# Altium schematic sheet Sheet1.SchDoc
size A4
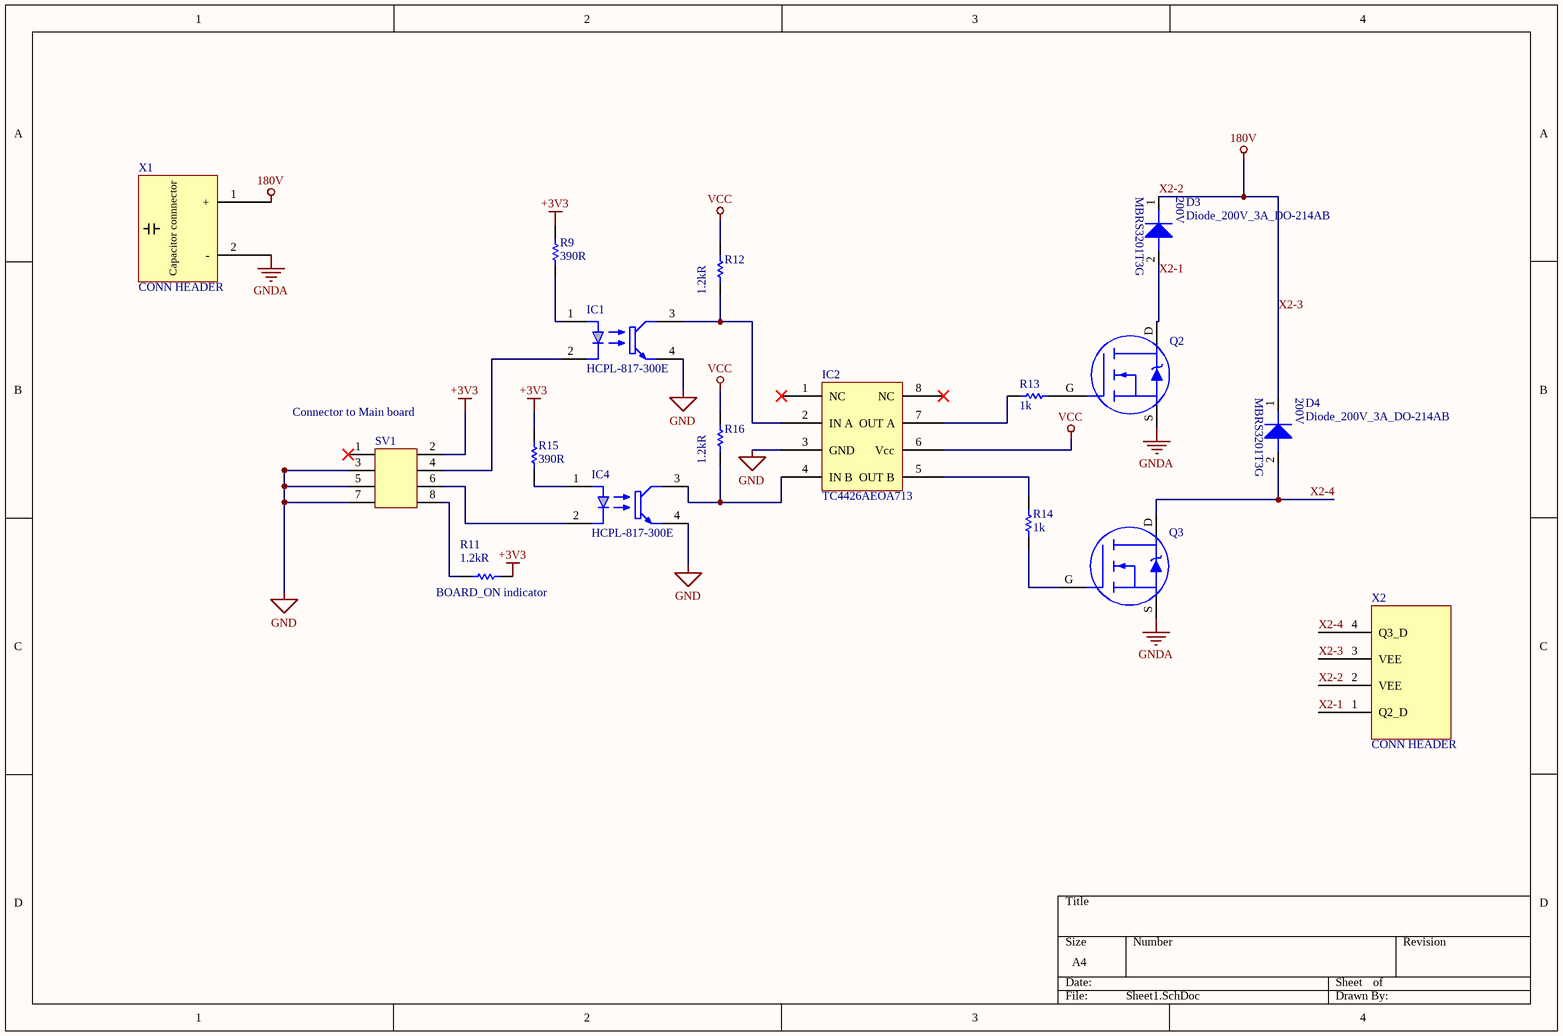
[diagram p0: Sheet1.SchDoc]

## Parts
D3  Diode_200V_3A_DO-214AB  [D320]
D4  Diode_200V_3A_DO-214AB  [D320]
IC1  HCPL-817-300E  [OPTOISOLATOR_5KV_TRANSISTOR_4SMD]
IC2  TC4426AEOA713  [CI Driver]
IC4  HCPL-817-300E  [OPTOISOLATOR_5KV_TRANSISTOR_4SMD]
Q2  IRFSL4127PBF  [TO-262]  (value not drawn)
Q3  IRFSL4127PBF  [TO-262]  (value not drawn)
R9  390R  [Resistor_0805]
R11  Res_1.2K_0805_1%  [0805]  (value not drawn)
R12  Res_1.2K_0805_1%  [0805]  (value not drawn)
R13  1k  [Resistor_0805]
R14  1k  [Resistor_0805]
R15  390R  [Resistor_0805]
R16  Res_1.2K_0805_1%  [0805]  (value not drawn)
SV1  90131-0764  [CONN HEADER VERT 8POS 2.54MM]  (value not drawn)
X1  CONN HEADER  [CONN HEADER R_A 2POS 3.98MM]
X2  CONN HEADER  [CONN HEADER R_A 4POS 3.98MM]

## Nets
+3V3: R9.2 R11.2 R15.2 SV1.2
GND: IC1.4(Emitter) IC2.3(GND) IC4.4(Emitter) SV1.3 SV1.5 SV1.7
GNDA: Q2.S Q3.S X1.2(-)
VCC: IC2.6(Vcc) R12.2 R16.2
X2-2: D3.1 D4.1 X1.1(+) X2.2(VEE) X2.3(VEE)  [also labelled 180V, X2-3]
X2-1: D3.2 Q2.D X2.1(Q2_D)
X2-4: D4.2 Q3.D X2.4(Q3_D)
NetIC1_1: IC1.1(Anode) R9.1
NetIC1_2: IC1.2(Cathode) SV1.4
NetIC1_3: IC1.3(Collector) IC2.2(IN_A) R12.1
NetIC2_4: IC2.4(IN_B) IC4.3(Collector) R16.1
NetIC2_5: IC2.5(OUT_B) R14.2
NetIC2_7: IC2.7(OUT_A) R13.1
NetIC4_1: IC4.1(Anode) R15.1
NetIC4_2: IC4.2(Cathode) SV1.6
NetQ2_G: Q2.G R13.2
NetQ3_G: Q3.G R14.1
NetR11_1: R11.1 SV1.8

Not connected (* = marked no-connect by the designer): IC2 1(NC)* 8(NC)*; SV1 1*

## Notes on the sheet
- (near SV1) Connector to Main board
- (near R11) BOARD_ON indicator
- (in symbol CONN HEADER R_A 2POS 3.96MM) Capacitor connnector

## Library data of the parts
D3 D4 = Diode_200V_3A_DO-214AB: ON SEMICONDUCTOR - MBRS3201T3G - Schottky Rectifier, 200 V, 3 A, Single, DO-214AB (SMC), 2 Pins, 840 mV; Peak Reverse Current: 5uA; Max Surge Current: 100A; Forward Voltage: 840mV; Forward Current: 3A; Recovery Time: 35ns; Max Repetitive Reverse Voltage (Vrrm): 200V; Polarity: Standard; Supplier 1: Digi-Key; Manufacturer: ON Semiconductor; Manufacturer Part Number: MBRS3201T3G; RoHS: Yes; Category: Schottky Diodes; Stock 1: 6509; Pricing 1: 1=0,60000, 10=0,53200, 25=0,49960, 100=0,36270, 250=0,34980, 500=0,30306, 1000=0,25792 (USD); Case/Package: SMC; Number of Pins: 2; Contact Plating: Tin,Matte; Min Operating Temperature: -55°C; Max Operating Temperature: 150°C; Package Quantity: 2500; Packaging: Tape and Reel; Average Rectified Current: 3A; Reverse Recovery Time: 35ns; Max Reverse Leakage Current: 5uA; Peak Non-Repetitive Surge Current: 100A; Max Forward Surge Current (Ifsm): 100A; Element Configuration: Single; Voltage Rating (DC): 200V; Current Rating: 3A; Output Current: 3A; Max Reverse Voltage (DC): 200V; Length: 7.11mm; Height: 2.26mm; Width: 6.1mm; Radiation Hardening: No; REACH SVHC: No SVHC; Lead Free: Lead Free; Halogen Free: Halogen Free; ComponentLink1URL: https://datasheet.ciiva.com/923/mbrs3201t3-d-923290.pdf?src-supplier=Avnet; ComponentLink1Description: https://datasheet.ciiva.com/923/mbrs3201t3-d-923290.pdf?src-supplier=Avnet; ComponentLink2URL: https://datasheet.ciiva.com/22659/1708281-22659072.pdf?src-supplier=Element14; ComponentLink2Description: https://datasheet.ciiva.com/22659/1708281-22659072.pdf?src-supplier=Element14; ComponentLink3URL: https://datasheet.ciiva.com/916/mbrs3201t3-916256.pdf?src-supplier=Digi-Key; ComponentLink3Description: https://datasheet.ciiva.com/916/mbrs3201t3-916256.pdf?src-supplier=Digi-Key; ComponentLink4URL: https://datasheet.ciiva.com/26912/getdatasheetpartid-105192-26912741.pdf?src-supplier=Verical; ComponentLink4Description: https://datasheet.ciiva.com/26912/getdatasheetpartid-105192-26912741.pdf?src-supplier=Verical; ComponentLink5URL: https://datasheet.ciiva.com/25948/mbrs3201t3-d-25948165.pdf?src-supplier=Avnet+Europe; ComponentLink5Description: https://datasheet.ciiva.com/25948/mbrs3201t3-d-25948165.pdf?src-supplier=Avnet+Europe; ComponentLink6URL: https://datasheet.ciiva.com/8294/mbrs3201t3-d-8294973.pdf?src-supplier=Avnet; ComponentLink6Description: https://datasheet.ciiva.com/8294/mbrs3201t3-d-8294973.pdf?src-supplier=Avnet; ComponentLink7URL: https://datasheet.ciiva.com/916/mbrs3201t3-d-916255.pdf?src-supplier=Digi-Key; ComponentLink7Description: https://datasheet.ciiva.com/916/mbrs3201t3-d-916255.pdf?src-supplier=Digi-Key; ComponentLink8URL: https://datasheet.ciiva.com/916/mbrs3201t3-d-916257.pdf?src-supplier=Digi-Key; ComponentLink8Description: https://datasheet.ciiva.com/916/mbrs3201t3-d-916257.pdf?src-supplier=Digi-Key; ComponentLink9URL: https://datasheet.ciiva.com/16393/mbrs3201t3-d-16393647.pdf?src-supplier=Future+Electronics; ComponentLink9Description: https://datasheet.ciiva.com/16393/mbrs3201t3-d-16393647.pdf?src-supplier=Future+Electronics; Supplier Part Number 1: MBRS3201T3GOSCT-ND
IC1 IC4 = HCPL-817-300E: OPTOISOLATOR 5KV TRANSISTOR 4SMD; Manufacturer: Broadcom Avago; Number of Channels: 1; Forward Current: 50mA; Forward Voltage: 1.4V; Collector Emitter Voltage (VCEO): 35V; Max Output Voltage: 70V; Max Power Dissipation: 200mW; Rise Time: 18000ns; Reverse Breakdown Voltage: 6V; Current Transfer Ratio: 600%; Collector Emitter Saturation Voltage: 200mV; Input Current: 20mA; Approvals: UL,CSA,VDE; Supplier 1: Digi-Key; Manufacturer Part Number: HCPL-817-300E; RoHS: Yes; Category: Optocouplers; Stock 1: 19011; Pricing 1: 1=0,62000, 10=0,44500, 100=0,29090, 500=0,20908, 1000=0,16362, 2500=0,14998, 5000=0,13635, 10000=0,12726, 25000=0,12272 (USD); Mount: Surface Mount; Case/Package: SMD/SMT; Number of Pins: 4; Contact Plating: Tin,Matte; Min Operating Temperature: -30°C; Max Operating Temperature: 100°C; Packaging: Rail/Tube; Output Current per Channel: 50mA; Isolation Voltage: 5kV; Package Quantity: 100; Max Collector Current: 50mA; Max Input Current: 50mA; Fall Time: 18000ns; Number of Elements: 1; Power Dissipation: 200mW; Number of Circuits: 1; Radiation Hardening: No; REACH SVHC: No SVHC; Lead Free: Lead Free; ComponentLink1URL: https://datasheet.ciiva.com/14169/av02-0265en-14169345.pdf?src-supplier=Distrelec; ComponentLink1Description: https://datasheet.ciiva.com/14169/av02-0265en-14169345.pdf?src-supplier=Distrelec; ComponentLink2URL: https://datasheet.ciiva.com/11771/0900766b80db8749-11771859.pdf?src-supplier=RSComponents; ComponentLink2Description: https://datasheet.ciiva.com/11771/0900766b80db8749-11771859.pdf?src-supplier=RSComponents; ComponentLink3URL: https://datasheet.ciiva.com/15118/getdatasheetpartid-148838-15118837.pdf?src-supplier=Verical; ComponentLink3Description: https://datasheet.ciiva.com/15118/getdatasheetpartid-148838-15118837.pdf?src-supplier=Verical; ComponentLink4URL: https://datasheet.ciiva.com/29301/140230-da-01-en-fototransistor-optokoppler-hcpl-817-300e-29301503.pdf?src-supplier=Conrad; ComponentLink4Description: https://datasheet.ciiva.com/29301/140230-da-01-en-fototransistor-optokoppler-hcpl-817-300e-29301503.pdf?src-supplier=Conrad; ComponentLink5URL: https://datasheet.ciiva.com/4702/v02-0265en-106799-4702250.pdf?src-supplier=Mouser; ComponentLink5Description: https://datasheet.ciiva.com/4702/v02-0265en-106799-4702250.pdf?src-supplier=Mouser; ComponentLink6URL: https://datasheet.ciiva.com/8065/1266126-8065797.pdf?src-supplier=Element14; ComponentLink6Description: https://datasheet.ciiva.com/8065/1266126-8065797.pdf?src-supplier=Element14
IC2 = TC4426AEOA713: MOSFET DRVR 1.5A 2-OUT Lo Side Inv 8-Pin SOIC N T/R; Manufacturer: Microchip; Supplier 1: Digi-Key; Manufacturer Part Number: TC4426AEOA713; RoHS: Yes; Category: Gate Drivers; Stock 1: 3145; Pricing 1: 1=1,32000, 25=1,10000, 100=1,00000 (USD); ComponentLink1URL: https://datasheet.ciiva.com/1951/filehandler-aspxddocname-en026002-1951430.pdf?src-supplier=Digi-Key; ComponentLink1Description: https://datasheet.ciiva.com/1951/filehandler-aspxddocname-en026002-1951430.pdf?src-supplier=Digi-Key; ComponentLink2URL: https://datasheet.ciiva.com/16293/21422e-16293354.pdf?src-supplier=Future+Electronics; ComponentLink2Description: https://datasheet.ciiva.com/16293/21422e-16293354.pdf?src-supplier=Future+Electronics; ComponentLink3URL: https://datasheet.ciiva.com/17236/21423f-17236125.pdf?src-supplier=Avnet+Europe; ComponentLink3Description: https://datasheet.ciiva.com/17236/21423f-17236125.pdf?src-supplier=Avnet+Europe; ComponentLink4URL: https://datasheet.ciiva.com/8199/21423f-8199823.pdf?src-supplier=Avnet; ComponentLink4Description: https://datasheet.ciiva.com/8199/21423f-8199823.pdf?src-supplier=Avnet
Q2 Q3 = IRFSL4127PBF: 200V Single N-Channel HEXFET Power MOSFET Switch in a TO-262 package; Manufacturer: Infineon; Turn-Off Delay Time: 56ns; Turn-On Delay Time: 17ns; Gate to Source Voltage (Vgs): 20V; Power Dissipation: 375W; Drain to Source Resistance: 22mR; Supplier 1: Mouser; Manufacturer Part Number: IRFSL4127PBF; RoHS: Yes; Category: MOSFETs; Stock 1: 44; Pricing 1: 1=4,88000, 10=4,15000, 100=3,32000, 500=2,95000, 1000=2,63000, 2000=2,63000 (USD); Mount: Through Hole; Case/Package: TO-262; Number of Pins: 3; Min Operating Temperature: -55°C; Max Operating Temperature: 175°C; Drain to Source Voltage (Vdss): 200V; Max Dual Supply Voltage: 200V; Length: 0.42inch; Height: 0.38inch; Width: 0.19inch; Lead Free: Lead Free; Halogen Free: Halogen Free; ComponentLink1URL: https://www.alliedelec.com/m/d/905bffad1195b62bb948415acb3fbc50.pdf?src-supplier=Allied+Electronics; ComponentLink1Description: https://www.alliedelec.com/m/d/905bffad1195b62bb948415acb3fbc50.pdf?src-supplier=Allied+Electronics
R9 R15 = Res_390R_0805: RES SMD 0805 390R 5% 1/8W; Tolerance: 1%; Value: 1K; Supplier 1: Digi-Key; Supplier Part Number 1: 311-390ARDKR-ND
R11 R12 R16 = Res_1.2K_0805_1%: PANASONIC ELECTRONIC COMPONENTS - ERJ6ENF1201V - RES, THICK FILM, 1K2, 125MW, 1%, REEL; Manufacturer Part Number: ERJ-6ENF1201V; Resistance: 1.2kR; Temperature Coefficient: 100ppm/°C; Voltage Rating: 150V; Supplier 1: Digi-Key; Manufacturer: Panasonic; RoHS: Yes; Category: Chip SMD Resistors; Stock 1: 22603; Pricing 1: 1=0,10000, 10=0,07200, 100=0,02750, 1000=0,01210, 2500=0,01045 (USD); Mount: Surface Mount; Case/Package: 0805; Contact Plating: Tin; Case Code (Metric): 2012; Case Code (Imperial): 0805; Min Operating Temperature: -55°C; Max Operating Temperature: 155°C; Tolerance: 1%; Composition: Thick Film; Power Rating: 125mW; Packaging: Tape and Reel; Package Quantity: 1; Number of Terminations: 2; Military Standard: Not; Max Power Dissipation: 125mW; Termination: SMD/SMT; Voltage Rating (DC): 150V; Features: Automotive AEC-Q200; Length: 2mm; Height: 0.6mm; Width: 0.049inch; Depth: 1.25mm; Radiation Hardening: No; Lead Free: Lead Free; REACH SVHC: No SVHC; ComponentLink1URL: https://datasheet.ciiva.com/11821/0900766b80f80784-11821543.pdf?src-supplier=RSComponents; ComponentLink1Description: https://datasheet.ciiva.com/11821/0900766b80f80784-11821543.pdf?src-supplier=RSComponents; ComponentLink2URL: https://datasheet.ciiva.com/7802/426256-7802438.pdf?src-supplier=Element14; ComponentLink2Description: https://datasheet.ciiva.com/7802/426256-7802438.pdf?src-supplier=Element14; ComponentLink3URL: https://datasheet.ciiva.com/16775/70260748-16775350.pdf?src-supplier=Allied+Electronics; ComponentLink3Description: https://datasheet.ciiva.com/16775/70260748-16775350.pdf?src-supplier=Allied+Electronics; ComponentLink4URL: https://datasheet.ciiva.com/9198/aoa0000ce2-9198663.pdf?src-supplier=Avnet; ComponentLink4Description: https://datasheet.ciiva.com/9198/aoa0000ce2-9198663.pdf?src-supplier=Avnet; ComponentLink5URL: https://datasheet.ciiva.com/22687/1678782-22687448.pdf?src-supplier=Element14; ComponentLink5Description: https://datasheet.ciiva.com/22687/1678782-22687448.pdf?src-supplier=Element14; ComponentLink6URL: https://datasheet.ciiva.com/46372/1678782-46372712.pdf?src-supplier=Element14; ComponentLink6Description: https://datasheet.ciiva.com/46372/1678782-46372712.pdf?src-supplier=Element14; ComponentLink7URL: https://datasheet.ciiva.com/46372/1678782-46372713.pdf?src-supplier=Element14; ComponentLink7Description: https://datasheet.ciiva.com/46372/1678782-46372713.pdf?src-supplier=Element14; ComponentLink8URL: https://datasheet.ciiva.com/22667/1678782-22667898.pdf?src-supplier=Element14; ComponentLink8Description: https://datasheet.ciiva.com/22667/1678782-22667898.pdf?src-supplier=Element14; ComponentLink9URL: https://datasheet.ciiva.com/17215/aoa0000ce2-17215019.pdf?src-supplier=Avnet+Europe; ComponentLink9Description: https://datasheet.ciiva.com/17215/aoa0000ce2-17215019.pdf?src-supplier=Avnet+Europe; ComponentLink10URL: https://datasheet.ciiva.com/6138/426256-6138188.pdf?src-supplier=Farnell; ComponentLink10Description: https://datasheet.ciiva.com/6138/426256-6138188.pdf?src-supplier=Farnell; ComponentLink11URL: https://datasheet.ciiva.com/24069/aoa0000ce2-24069708.pdf?src-supplier=Mouser; ComponentLink11Description: https://datasheet.ciiva.com/24069/aoa0000ce2-24069708.pdf?src-supplier=Mouser; ComponentLink12URL: https://datasheet.ciiva.com/30129/aoa0000ce2-30129052.pdf?src-supplier=Onlinecomponents.com; ComponentLink12Description: https://datasheet.ciiva.com/30129/aoa0000ce2-30129052.pdf?src-supplier=Onlinecomponents.com; ComponentLink13URL: https://datasheet.ciiva.com/16773/70260748-16773646.pdf?src-supplier=Allied+Electronics; ComponentLink13Description: https://datasheet.ciiva.com/16773/70260748-16773646.pdf?src-supplier=Allied+Electronics
R13 R14 = Res_1k_0805: RES SMD 0805 1k 1/8W; Value: RC0805FR-071KL; Supplier 1: Digi-Key; Supplier 2: Mouser; Supplier Part Number 1: 311-1.00KCRDKR-ND; Supplier Part Number 2: 603-RC0805FR-071KL
SV1 = 90131-0764: Conn Unshrouded Header HDR 8 POS 2.54mm Solder ST Thru-Hole Tray; Manufacturer: Molex; Number of Positions: 8; Gender: Male; Current Rating: 3A; Voltage Rating: 350V; Contact Resistance: 20mR; Insulation Resistance: 5GR; Supplier 1: Digi-Key; Manufacturer Part Number: 90131-0764; RoHS: Yes; Category: Connectors; Stock 1: 1061; Pricing 1: 1=2,24000, 10=2,03400, 100=1,74300, 500=1,45250, 1000=1,24500, 5000=1,10390, 10000=1,07900 (USD); Mount: Through Hole; Housing Color: Black; Contact Plating: Gold; Contact Material: Brass; Housing Material: Polyester; Min Operating Temperature: -55°C; Max Operating Temperature: 125°C; Orientation: Straight; Number of Rows: 2; Packaging: Tray; Termination: Solder; Number of Contacts: 8; Package Quantity: 2400; Number of Poles: 8; Voltage Rating (AC): 350V; Working Voltage: 350V; Pitch: 2.54mm; Lead Pitch: 2.54mm; Radiation Hardening: No; Lead Free: Lead Free; REACH SVHC: Unknown; ComponentLink1URL: https://datasheet.ciiva.com/30231/0901310764-pcb-headers-30231232.pdf?src-supplier=Onlinecomponents.com; ComponentLink1Description: https://datasheet.ciiva.com/30231/0901310764-pcb-headers-30231232.pdf?src-supplier=Onlinecomponents.com; ComponentLink2URL: https://datasheet.ciiva.com/11748/0900766b81280103-11748626.pdf?src-supplier=RSComponents; ComponentLink2Description: https://datasheet.ciiva.com/11748/0900766b81280103-11748626.pdf?src-supplier=RSComponents; ComponentLink3URL: https://datasheet.ciiva.com/5158/0901310764-pcb-headers-151525-5158722.pdf?src-supplier=Mouser; ComponentLink3Description: https://datasheet.ciiva.com/5158/0901310764-pcb-headers-151525-5158722.pdf?src-supplier=Mouser
X1 = CONN HEADER R_A 2POS 3.96MM: Conn Wire to Board HDR 2 POS 3.96mm Solder RA Thru-Hole KK® Bag; Manufacturer 1: Molex; Number of Positions: 2; Contact Resistance: 10mR; Gender: Male; Connector Type: Male Pin; Supplier 1: Digi-Key; Manufacturer Part Number 1: 26-60-5020; Stock 1: 7578; Pricing 1: 1=0,32000, 10=0,30300, 100=0,21240, 500=0,18202, 1000=0,15169, 5000=0,13002, 10000=0,12135 (USD); RoHS: Yes; Mount: Through Hole; Contact Plating: Tin,Copper; Contact Material: Bronze,Brass; Color: Natural; Housing Color: White; Housing Material: Polyester; Min Operating Temperature: 0°C; Max Operating Temperature: 75°C; Number of Rows: 1; Termination: Solder; Number of Contacts: 2; Fastening Type: Friction; Packaging: Bulk; Orientation: Right Angle; Length: 7.77mm; Pitch: 3.96mm; Contact Mating Length: 0.45inch; Depth: 23.14mm; ComponentLink1URL: https://datasheet.ciiva.com/711/026605020-sd-711883.pdf?src-supplier=Digi-Key; ComponentLink1Description: https://datasheet.ciiva.com/711/026605020-sd-711883.pdf?src-supplier=Digi-Key; ComponentLink2URL: https://datasheet.ciiva.com/22827/0900766b80d6bf1d-22827278.pdf?src-supplier=RSComponents; ComponentLink2Description: https://datasheet.ciiva.com/22827/0900766b80d6bf1d-22827278.pdf?src-supplier=RSComponents; ComponentLink3URL: https://datasheet.ciiva.com/30179/80070026605020-pcb-headers-30179412.pdf?src-supplier=Onlinecomponents.com; ComponentLink3Description: https://datasheet.ciiva.com/30179/80070026605020-pcb-headers-30179412.pdf?src-supplier=Onlinecomponents.com; ComponentLink4URL: https://datasheet.ciiva.com/15217/getdatasheetpartid-299439-15217821.pdf?src-supplier=Verical; ComponentLink4Description: https://datasheet.ciiva.com/15217/getdatasheetpartid-299439-15217821.pdf?src-supplier=Verical; Supplier Part Number 1: WM4640-ND
X2 = CONN HEADER R_A 4POS 3.96MM: Headers & Wire Housings R/A PCB HDR 4P TIN FRICTION LOCK; Manufacturer 1: Molex; Number of Positions: 4; Gender: Male; Voltage Rating (DC): 250V; Insulation Resistance: 50GR; Number of Lines: 1; Contact Resistance: 10mR; Current Rating: 7A; Pitch: 3.96mm; Glow Wire Compliant: Non-compliant; Supplier 1: Arrow; Manufacturer Part Number 1: 26-60-5040; Stock 1: 13747; Pricing 1: 1=0,37980, 10=0,35730, 100=0,28160, 500=0,24650, 1000=0,20520, 5000=0,18050, 10000=0,16730, 1=0,42000, 10=0,39510, 100=0,31430, 500=0,27630, 1000=0,26400, 1=0,41740, 10=0,38930, 100=0,29830, 500=0,25770, 1000=0,21140, 5000=0,18430, 10000=0,17000 (USD); RoHS: Yes; Mount: Through Hole; Housing Color: Natural; Material: Polyester; Contact Plating: Tin,Copper; Contact Material: Brass,Bronze,Tin; Housing Material: Polyester; Min Operating Temperature: 0°C; Max Operating Temperature: 75°C; Termination: Solder; Number of Contacts: 4; Number of Circuits: 4; Orientation: Right Angle; Number of Rows: 1; Number of Poles: 4; Voltage Rating: 250V; Contact Gender: Male; Package Quantity: 350; Packaging: Bulk; Radiation Hardening: No; Flammability Rating: UL94 V-0; Lead Free: Lead Free; REACH SVHC: Unknown; ComponentLink1URL: https://datasheet.ciiva.com/19454/880132-19454025.pdf?src-supplier=Jameco; ComponentLink1Description: https://datasheet.ciiva.com/19454/880132-19454025.pdf?src-supplier=Jameco; ComponentLink2URL: https://datasheet.ciiva.com/10029/0026605040-pcb-headers-10029266.pdf?src-supplier=Avnet; ComponentLink2Description: https://datasheet.ciiva.com/10029/0026605040-pcb-headers-10029266.pdf?src-supplier=Avnet; ComponentLink3URL: https://datasheet.ciiva.com/7844/1631036-7844119.pdf?src-supplier=Element14; ComponentLink3Description: https://datasheet.ciiva.com/7844/1631036-7844119.pdf?src-supplier=Element14; ComponentLink4URL: https://datasheet.ciiva.com/5157/0026605040-pcb-headers-159671-5157677.pdf?src-supplier=Mouser; ComponentLink4Description: https://datasheet.ciiva.com/5157/0026605040-pcb-headers-159671-5157677.pdf?src-supplier=Mouser; ComponentLink5URL: https://datasheet.ciiva.com/11749/0900766b80d6bf1d-11749079.pdf?src-supplier=RSComponents; ComponentLink5Description: https://datasheet.ciiva.com/11749/0900766b80d6bf1d-11749079.pdf?src-supplier=RSComponents; ComponentLink6URL: https://datasheet.ciiva.com/30188/171410026605040-pcb-headers-30188011.pdf?src-supplier=Onlinecomponents.com; ComponentLink6Description: https://datasheet.ciiva.com/30188/171410026605040-pcb-headers-30188011.pdf?src-supplier=Onlinecomponents.com; Supplier Part Number 1: 26-60-5040